# Altium schematic sheet XB900.SchDoc
size A
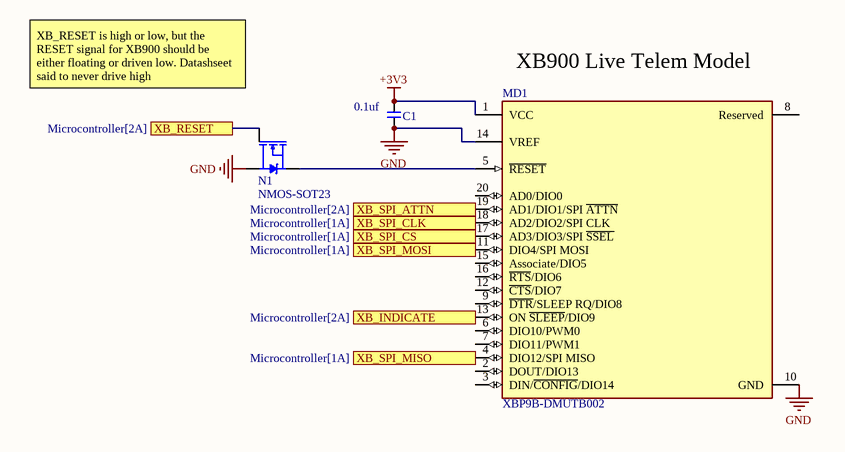
[diagram p0: XB900.SchDoc]

## Parts
C1  0.1uf  [CAP-0603]
MD1  XBP9B-DMUTB002  [FP-XBP9B-DMUTB002-MFG]
N1  NMOS-SOT23  [SOT23]

## Ports
XB_INDICATE (see Microcontroller[2A]), XB_RESET (see Microcontroller[2A]), XB_SPI_ATTN (see Microcontroller[2A]), XB_SPI_CLK (see Microcontroller[1A]), XB_SPI_CS (see Microcontroller[1A]), XB_SPI_MISO (see Microcontroller[1A]), XB_SPI_MOSI (see Microcontroller[1A])

## Nets
+3V3: C1.2 MD1.1(VCC)
GND: C1.1 MD1.10(GND) MD1.14(VREF) N1.2(S)
XB_INDICATE: MD1.13(ON_~{SLEEP}/DIO9) ; port XB_INDICATE
XB_RESET: N1.1(G) ; port XB_RESET
XB_SPI_ATTN: MD1.19(AD1/DIO1/SPI_~{ATTN}) ; port XB_SPI_ATTN
XB_SPI_CLK: MD1.18(AD2/DIO2/SPI_CLK) ; port XB_SPI_CLK
XB_SPI_CS: MD1.17(AD3/DIO3/SPI_~{SSEL}) ; port XB_SPI_CS
XB_SPI_MISO: MD1.4(DIO12/SPI_MISO) ; port XB_SPI_MISO
XB_SPI_MOSI: MD1.11(DIO4/SPI_MOSI) ; port XB_SPI_MOSI
NetMD1_5: MD1.5(~{RESET}) N1.3(D)

Not connected (* = marked no-connect by the designer): MD1 2(DOUT/DIO13) 3(DIN/~{CONFIG}/DIO14) 6(DIO10/PWM0) 7(DIO11/PWM1) 8(Reserved) 9(~{DTR}/SLEEP_RQ/DIO8) 12(~{CTS}/DIO7) 15(Associate/DIO5) 16(~{RTS}/DIO6) 20(AD0/DIO0)

## Notes on the sheet
- XB_RESET is high or low, but the RESET signal for XB900 should be either floating or driven low. Datashseet said to never drive high
- (near MD1) XB900 Live Telem Model

## Library data of the parts
C1 = CMP-009-000303-1: Source: ife19_Elec_Library.SchLib; Design Item ID: CAP-0603
MD1 = CMP-84319-000004-1: RX TXRX MOD ISM < 1GHZ U.FL TH; Max Supply Voltage: 3.6V; Current - Transmitting: 215mA; Sensitivity: -101dBm; Min Frequency: 902MHz; Memory Size: 2KB; Max Frequency: 928MHz; Min Supply Voltage: 2.4V; Current - Receiving: 29mA; Interface: SPI; Data Rate: 200Kbps; Frequency: 900MHz; Output Power (dBm): 24dBm; Number of Pins: 20; Series: XBee-Pro™; Max Operating Temperature: 85°C; Radiation Hardening: No; Min Operating Temperature: -40°C; Package Quantity: 1; RAM Size: 2KB; Packaging: Bulk; Case/Package: Module
N1 = CMP-009-000184-1: Design Item ID: NMOS-SOT23; Source: ife19_Elec_Library.SchLib